# EAGLE design Altimeter (EAGLE 8.1.0)
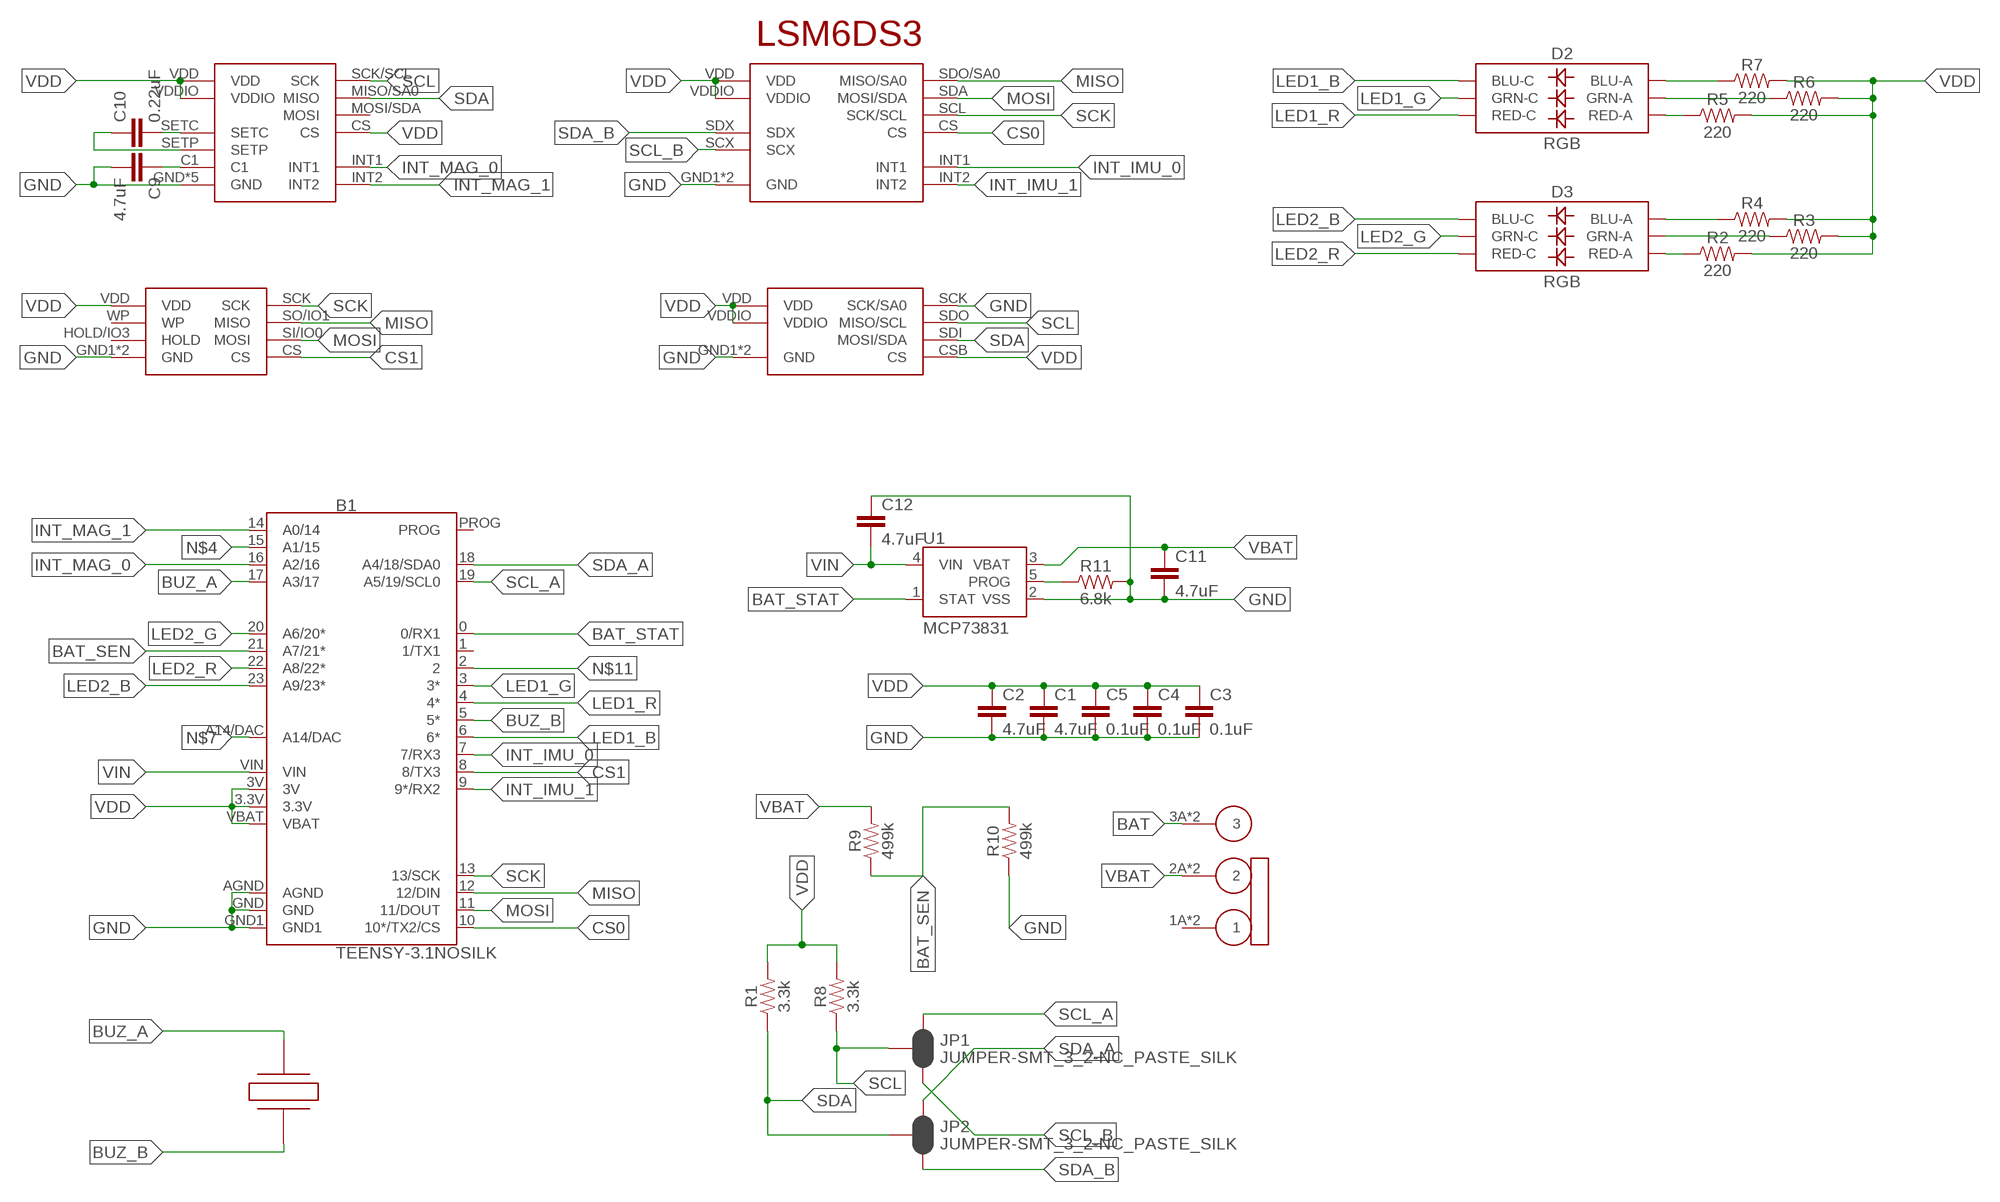
[diagram p0: schematic, sheet 1]

## Parts
B1  TEENSY-3.1NOSILK  [TEENSY-3.1_NOSILK]
C1  4.7uF  4.7UF0603  [0603]
C2  4.7uF  4.7UF0603  [0603]
C3  0.1uF  0.1UF-0603-25V-5%  [0603]
C4  0.1uF  0.1UF-0603-25V-5%  [0603]
C5  0.1uF  0.1UF-0603-25V-5%  [0603]
C9  4.7uF  4.7UF0603  [0603]
C10  0.22uF  0.22UF-0603-25V-10%  [0603]
C11  4.7uF  4.7UF0603  [0603]
C12  4.7uF  4.7UF0603  [0603]
D2  RGB  LED-RGBPLCC-6  [PLCC-6-LED]
D3  RGB  LED-RGBPLCC-6  [PLCC-6-LED]
JP1  JUMPER-SMT_3_2-NC_PASTE_SILK  [SMT-JUMPER_3_2-NC_PASTE_SILK]
JP2  JUMPER-SMT_3_2-NC_PASTE_SILK  [SMT-JUMPER_3_2-NC_PASTE_SILK]
R1  3.3k  3.3KOHM-0603-1/10W-1%  [0603]
R2  220  22OHM-0603-1/10W-1%  [0603]
R3  220  22OHM-0603-1/10W-1%  [0603]
R4  220  22OHM-0603-1/10W-1%  [0603]
R5  220  22OHM-0603-1/10W-1%  [0603]
R6  220  22OHM-0603-1/10W-1%  [0603]
R7  220  22OHM-0603-1/10W-1%  [0603]
R8  3.3k  3.3KOHM-0603-1/10W-1%  [0603]
R9  499k  1MOHM-0603-1/4W-5%  [0603]
R10  499k  1MOHM-0603-1/4W-5%  [0603]
R11  6.8k  2.0KOHM-0603-1/10W-5%  [0603]
U1  MCP73831  [SOT23-5]
U$1  BMP280  [BMP280]
U$3  JS102011JAQN  [JS102011JAQN]
U$5  LSM6DS3  [LSM6DS3]
U$6  LSM303D  [LSM303D]
U$7  PKLCS1212  [PKLCS1212]
U$8  S25FL256S  [S25FL256S]

## Nets
BAT: U$3.3A U$3.3B
BAT_SEN: B1.21(A7/21*) R9.1 R10.2
BAT_STAT: B1.0(0/RX1) U1.1(STAT)
BUZ_A: B1.17(A3/17) U$7.2
BUZ_B: B1.5(5*) U$7.1
CS0: B1.10(10*/TX2/CS) U$5.CS
CS1: B1.8(8/TX3) U$8.CS
GND: B1.AGND B1.GND B1.GND1 C1.2 C2.2 C3.2 C4.2 C5.2 C9.2 C11.2 C12.1 R10.1 R11.2 U1.2(VSS) U$1.GND1(GND) U$1.GND2(GND) U$1.SCK(SCK/SA0) U$5.GND1(GND) U$5.GND2(GND) U$6.GND U$6.GND1(GND) U$6.GND2(GND) U$6.GND3(GND) U$6.GND4(GND) U$8.GND1(GND) U$8.GND2(GND)
INT_IMU_0: B1.7(7/RX3) U$5.INT1
INT_IMU_1: B1.9(9*/RX2) U$5.INT2
INT_MAG_0: B1.16(A2/16) U$6.INT1
INT_MAG_1: B1.14(A0/14) U$6.INT2
LED1_B: B1.6(6*) D2.CB(BLU-C)
LED1_G: B1.3(3*) D2.CG(GRN-C)
LED1_R: B1.4(4*) D2.CR(RED-C)
LED2_B: B1.23(A9/23*) D3.CB(BLU-C)
LED2_G: B1.20(A6/20*) D3.CG(GRN-C)
LED2_R: B1.22(A8/22*) D3.CR(RED-C)
MISO: B1.12(12/DIN) U$5.SDO/SA0(MISO/SA0) U$8.SO/IO1(MISO)
MOSI: B1.11(11/DOUT) U$5.SDA(MOSI/SDA) U$8.SI/IO0(MOSI)
N$1: D2.AB(BLU-A) R7.1
N$3: D2.AG(GRN-A) R6.1
N$4: B1.15(A1/15)
N$6: R11.1 U1.5(PROG)
N$7: B1.A14/DAC
N$9: D2.AR(RED-A) R5.1
N$11: B1.2
N$30: D3.AB(BLU-A) R4.1
N$33: D3.AG(GRN-A) R3.1
N$42: D3.AR(RED-A) R2.1
N$46: C10.2 U$6.SETC
N$47: C10.1 U$6.SETP
N$48: C9.1 U$6.C1
SCK: B1.13(13/SCK) U$5.SCL(SCK/SCL) U$8.SCK
SCL: JP1.2 R8.1 U$1.SDO(MISO/SCL) U$6.SCK/SCL(SCK)
SCL_A: B1.19(A5/19/SCL0) JP1.1
SCL_B: JP1.3 U$5.SCX
SDA: JP2.2 R1.1 U$1.SDI(MOSI/SDA) U$6.MISO/SA0(MISO)
SDA_A: B1.18(A4/18/SDA0) JP2.1
SDA_B: JP2.3 U$5.SDX
VBAT: C11.1 R9.2 U1.3(VBAT) U$3.2A U$3.2B
VDD: B1.3.3V B1.3V B1.VBAT C1.1 C2.1 C3.1 C4.1 C5.1 R1.2 R2.2 R3.2 R4.2 R5.2 R6.2 R7.2 R8.2 U$1.CSB(CS) U$1.VDD U$1.VDDIO U$5.VDD U$5.VDDIO U$6.CS U$6.VDD U$6.VDDIO U$8.VDD
VIN: B1.VIN C12.2 U1.4(VIN)
Unconnected: B1.1(1/TX1) B1.PROG U$3.1A U$3.1B U$6.MOSI/SDA(MOSI) U$8.HOLD/IO3(HOLD) U$8.WP

## Library data of the parts
B1 = SparkFun-Boards:TEENSY-3.1: Teensy 3+ Footprint Mechanical footprint with connectors for Teensy Development Board with ARM Cortex. SparkFun Products: Teensy 3.2 <https://www.sparkfun.com/products/13736> Teensy LC <https://www.sparkfun.com/products/13305>; SF_ID: DEV-12646
C1 C2 C9 C11 C12 = SparkFun-Capacitors:4.7UF: 4.7µF ceramic capacitors A capacitor is a passive two-terminal electrical component used to store electrical energy temporarily in an electric field.; PROD_ID: CAP-08280
C3-C5 = SparkFun-Capacitors:0.1UF: 0.1µF ceramic capacitors A capacitor is a passive two-terminal electrical component used to store electrical energy temporarily in an electric field.; PROD_ID: CAP-08604
C10 = SparkFun-Capacitors:0.22UF: 0.22µF ceramic capacitors A capacitor is a passive two-terminal electrical component used to store electrical energy temporarily in an electric field.; PROD_ID: CAP-07822
D2 D3 = SparkFun-LED:LED-RGB: LED-RGB 6 pin RGB LED (no common connector) Packages: PLCC-6 LED-TRICOLOR-5050 - No built-in IC SparkFun Products: Digital Sandbox <https://www.sparkfun.com/products/12651> LED- SMD RGB <https://www.sparkfun.com/products/10866>; PROD_ID: DIO-12113
JP1 JP2 = SparkFun-Jumpers:JUMPER-SMT_3_2-NC_PASTE: Normally closed solder jumper (2 of 2 connections) This jumper has an aperture in the stencil to allow solder paste to bridge both connections. Both connections are normally closed (NC). Wick off the solder to open the connection(s). Reapply solder to reclose the connection(s).
R1 R8 = SparkFun-Resistors:3.3KOHM: 3.3kΩ resistor A resistor is a passive two-terminal electrical component that implements electrical resistance as a circuit element. Resistors act to reduce current flow, and, at the same time, act to lower voltage levels within circuits. - Wikipedia; PROD_ID: RES-07851
R2-R7 = SparkFun-Resistors:22OHM: 22Ω resistor A resistor is a passive two-terminal electrical component that implements electrical resistance as a circuit element. Resistors act to reduce current flow, and, at the same time, act to lower voltage levels within circuits. - Wikipedia; PROD_ID: RES-08698; VALUE: 22
R9 R10 = SparkFun-Resistors:1MOHM: 1MΩ resistor A resistor is a passive two-terminal electrical component that implements electrical resistance as a circuit element. Resistors act to reduce current flow, and, at the same time, act to lower voltage levels within circuits. - Wikipedia; PROD_ID: RES-07868; VALUE: 1M
R11 = SparkFun-Resistors:2.0KOHM: 2kΩ resistor A resistor is a passive two-terminal electrical component that implements electrical resistance as a circuit element. Resistors act to reduce current flow, and, at the same time, act to lower voltage levels within circuits. - Wikipedia; PROD_ID: RES-08296; VALUE: 2.0k
U1 = SparkFun-IC-Power:MCP73831: MCP73831T Li-Ion, Li-Pol Controller Miniature single cell, fully integrated Li-Ion, Li-polymer charge management controller Datasheet <http://ww1.microchip.com/downloads/en/DeviceDoc/20001984g.pdf> SparkFun Products: SparkFun ESP32 Thing <https://www.sparkfun.com/products/13907> SparkFun 9DoF Razor IMU M0 <https://www.sparkfun.com/products/14001>; PROD_ID: IC-09995
U$1 = Altimeter:BMP280
U$3 = Altimeter:JS102011JAQN
U$5 = Altimeter:LSM6DS3
U$6 = Altimeter:LSM303D
U$7 = Altimeter:PKLCS1212
U$8 = Altimeter:S25FL256S

## Board
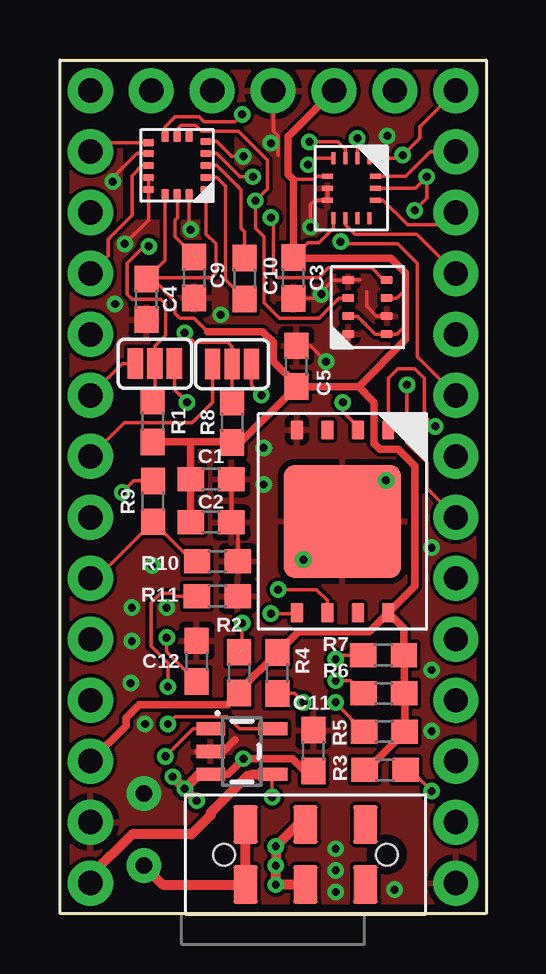
[diagram p1: board, top side]
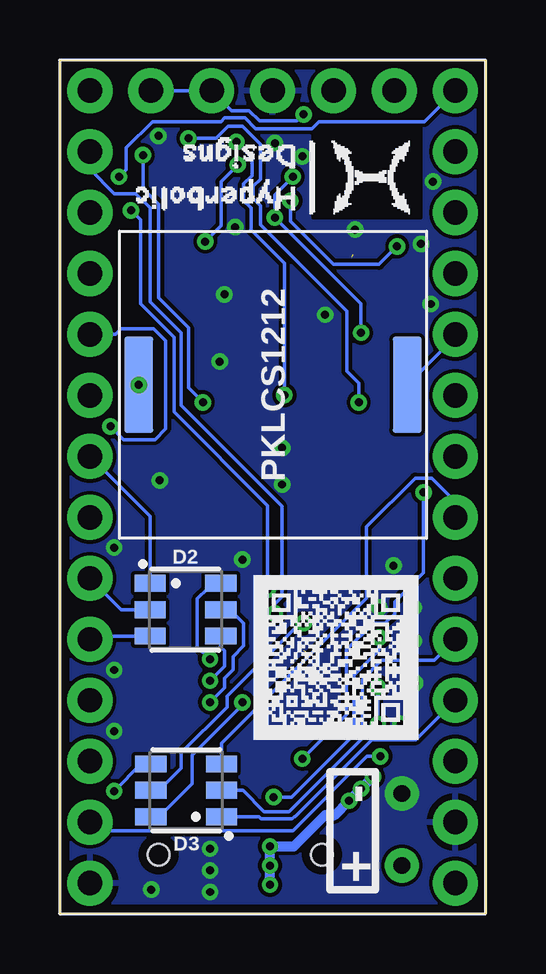
[diagram p2: board, bottom side, seen from below]

Size 17.76 x 35.56 mm. Coordinates in mm from the lower left corner, seen from the top.
Outline: 0,0 17.76,0 17.76,35.56 0,35.56 0,0
Copper layers (1*16): Top 0.035mm / dielectric 1.5mm / Bottom 0.035mm
Design rules "default *": minimum track width 6mil, minimum drill 13mil, track to track 6mil, track to pad 6mil, pad to pad 6mil, via to via 6mil, smd to smd 6mil, copper to edge 15mil, drill to drill 6mil, minimum pad ring 7mil, minimum via ring 7mil, stop-mask expansion 4mil, vias tented up to drill 15mil, thermal gap 10mil
tRestrict: area 2.7,29 to 7.2,33.1; area 11.3,29.4 to 12.8,31.1
bRestrict: area 2.7,29 to 7.2,33.1

### Footprints (pad centres in the part's own frame; a part is rotated, then mirrored left to right if it is on the bottom)
TEENSY-3.1_NOSILK = drill 1.016 pad 1.88: 0 7.62,-13.97; 1 7.62,-11.43; 2 7.62,-8.89; 3 7.62,-6.35; 3.3V 2.54,16.51; 3V -7.62,-11.43; 4 7.62,-3.81; 5 7.62,-1.27; 6 7.62,1.27; 7 7.62,3.81; 8 7.62,6.35; 9 7.62,8.89; 10 7.62,11.43; 11 7.62,13.97; 12 7.62,16.51; 13 -7.62,16.51; 14 -7.62,13.97; 15 -7.62,11.43; 16 -7.62,8.89; 17 -7.62,6.35; 18 -7.62,3.81; 19 -7.62,1.27; 20 -7.62,-1.27; 21 -7.62,-3.81; 22 -7.62,-6.35; 23 -7.62,-8.89; A14/DAC -5.08,16.51; AGND -7.62,-13.97; GND 0,16.51; GND1 7.62,-16.51; PROG -2.54,16.51; VBAT 5.08,16.51; VIN -7.62,-16.51
0603 = smd 1.1 x 1: 1 -0.85,0; 2 0.85,0
PLCC-6-LED = smd 1.3 x 0.7: AB 1.475,1.1; AG 1.475,-1.1; AR 1.475,0; CB -1.475,1.1; CG -1.475,-1.1; CR -1.475,0
SMT-JUMPER_3_2-NC_PASTE_SILK = smd 0.635 x 1.27: 1 -0.813,0; 2 0,0; 3 0.813,0
SOT23-5 = smd 0.55 x 1.2: 1 -0.95,-1.3; 2 0,-1.3; 3 0.95,-1.3; 4 0.95,1.3; 5 -0.95,1.3
BMP280 = smd 0.5 x 0.35: CSB 0.8,0.375; GND1 0.8,1.125; GND2 -0.8,0.375; SCK 0.8,-1.125; SDI 0.8,-0.375; SDO -0.8,-1.125; VDD -0.8,1.125; VDDIO -0.8,-0.375
JS102011JAQN = smd 1 x 1.6: 1A -2.5,-1.25; 1B -2.5,1.25; 2A 0,-1.25; 2B 0,1.25; 3A 2.5,-1.25; 3B 2.5,1.25 | hole 0.9: -3.4,0; 3.4,0
LSM6DS3 = smd 0.5 x 0.2: CS 2,0.75; GND1 0,1.25; GND2 0,0.75; SCL 2,1.25; SDA 2,1.75; VDDIO 0,1.75 | smd 0.2 x 0.5: INT1 0.25,2.5; INT2 0.75,0; NC1 1.25,0; NC2 1.75,0; SCX 0.75,2.5; SDO/SA0 1.75,2.5; SDX 1.25,2.5; VDD 0.25,0
LSM303D = smd 0.3 x 0.45: C1 0,1.2; CS 0.5,-1.2; GND -0.5,1.2; MISO/SA0 0,-1.2; MOSI/SDA -0.5,-1.2; VDD 0.5,1.2 | smd 0.45 x 0.3: GND1 -1.2,-1; GND2 1.2,-0.5; GND3 1.2,0.5; GND4 1.2,1; INT1 1.2,0; INT2 1.2,-0.95; SCK/SCL -1.2,-0.5; SETC -1.2,0.5; SETP -1.2,0; VDDIO -1.2,1
PKLCS1212 = smd 1.2 x 4: 1 0,0; 2 11.2,0
S25FL256S = smd 0.8 x 0.5: CS -3.81,1.905; GND1 -3.81,-1.905; HOLD/IO3 3.81,0.635; SCK 3.81,-0.635; SI/IO0 3.81,-1.905; SO/IO1 -3.81,0.635; VDD 3.81,1.905; WP -3.81,-0.635 | smd 4.7 x 4.9: GND2 0,0

### Placement (x,y rotation side)
B1  8.89,17.78 0 top
C1  6.3,18.1 0 top
C2  6.3,16.3 0 top
C3  9.73,26.48 270 top
C4  3.6,25.59 270 top
C5  9.86,22.81 90 top
C9  5.59,26.5 270 top
C10  7.7,26.46 270 top
C11  10.57,6.79 90 top
C12  5.7,10.52 270 top
D2  12.53,12.66 0 bottom
D3  12.49,5.13 180 bottom
JP1  7.17,22.89 0 top
JP2  3.96,22.91 0 top
R1  3.86,20.5 270 top
R2  7.47,10.04 270 top
R3  13.56,6 180 top
R4  9.07,10.03 90 top
R5  13.53,7.58 0 top
R6  13.51,9.17 0 top
R7  13.49,10.77 0 top
R8  7.17,20.47 270 top
R9  3.88,17.18 90 top
R10  6.57,14.68 180 top
R11  6.57,13.23 0 top
U1  7.59,6.75 270 top
U$1  12.82,25.27 180 top
U$3  10.24,2.46 180 top
U$5  11.15,28.98 0 top
U$6  4.89,31.17 180 top
U$7  14.47,22.03 0 bottom
U$8  11.79,16.34 270 top

### Tracks (layer width: path | path; a pad name or v marks a point on that pad's centre or on a via)
BAT  (via drill 0.7 pad 1.42)
  Top 0.406: v3.5,2 4.29,1.21 U$3.3B U$3.3A
BAT_SEN
  Top 0.152: B1.21 1.53,13.97 R9.1 5.53,14.68 R10.2
BAT_STAT  (via drill 0.33)
  Top 0.152: U1.1 5.55,7.7 v4.4,6.55
  Bottom 0.152: 16.45,3.81 B1.0 16.15,3.45 8.05,3.45 4.95,6.55 v4.4,6.55
BUZ_A
  Bottom 0.152: U$7.2 1.27,24.04 B1.17
BUZ_B  (via drill 0.33)
  Top 0.152: B1.5 15.3,17.72 15.3,18.8 14.47,19.62 U$7.1
  other vias: 14.47,22.03
CS0
  Top 0.152: U$5.CS 13.47,29.73 14.5,28.7 16,28.7 B1.10
CS1  (via drill 0.33)
  Top 0.152: v15.65,20.3 15.2,20.75 15.2,22.3 14.8,22.7 14.1,22.7 13.7,22.3 U$8.CS
  Bottom 0.152: B1.8 15.43,24.13 15.2,24.36 13.85,24.36 13.35,23.86 13.35,20.2 13.8,19.75 15.1,19.75 v15.65,20.3
GND  (via drill 0.33, 0.7 pad 1.42)
  Top 0.152: U$6.GND3 U$6.GND4 3.69,28.89 v2.7,27.9 | U$6.GND1 6.53,32.17 7.15,31.55 v7.65,31.55 | C3.2 10.63,25.64 11.39,26.39 U$1.SCK 12.5,26.4 | U$1.GND2 13.21,24.89 12.8,25.3 12.8,25.9 | C5.2 10.44,23.66 v11.1,23 | U$1.GND1 12.03,23.93 | U$5.GND1 U$5.GND2 10.62,29.73 10.45,29.55 v10.45,28.6 | U$6.GND 5.39,28.56 v5.45,28.5 | 9.1,31.6 9.1,32.4 8.9,32.6 B1.GND | 9.88,18.25 arc90 U$8.GND2 11.74,16.34 v10.15,14.75 | C1.2 C2.2 7.42,16.03 R10.1 | 5.7,11.62 C12.1 | v2.2,30.5 2.2,30.65 3.22,31.67 U$6.GND2
  Top 0.305: 6.55,6.75 U1.2 | U1.2 5.75,6.75 | B1.AGND | U1.2 6.8,6.75 7.3,7.25
  other vias: 2.3,25.4 2.95,9.6 3,11.35 3.85,14.5 15.5,7.6 15.5,15.25 13.6,18.05 3.55,7.9 13.65,32.4 6.7,24.95 10.9,25.8 8.5,19.4 13.95,1 4.45,12.75 3,12.75 15.5,10.15 8.8,32.1 11.5,2.7 11.5,1.8 11.5,0.9 8.5,17.88 3.5,5
  pour Top (rank 2): 0,0.05 0,35.55 17.75,35.55 17.75,0.05
  pour Bottom (rank 2): 0,0.05 0,35.55 17.75,35.55 17.75,0.05
INT_IMU_0  (via drill 0.33)
  Top 0.152: B1.7 14.9,23.2 14.9,27.1 14.1,27.9 11.8,27.9 v11.7,28 | U$5.INT1 10.62,31.48 v10.35,31.2
  Bottom 0.152: v10.35,31.2 10.35,31.18 11.05,30.48 11.05,28.65 v11.7,28
INT_IMU_1
  Top 0.152: B1.9 14.88,28.3 12.3,28.3 11.9,28.7 U$5.INT2
INT_MAG_0
  Top 0.152: U$6.INT1 3.42,31.17 3,30.75 3,29.1 2,28.1 2,27.4 B1.16
INT_MAG_1
  Top 0.152: U$6.INT2 1.64,32.12 B1.14
LED1_B
  Bottom 0.152: B1.6 14.01,16.55 D2.CB
LED1_G
  Bottom 0.152: B1.3 16.38,11.56 D2.CG
LED1_R
  Bottom 0.152: B1.4 15.21,12.66 D2.CR
LED2_B
  Bottom 0.152: D3.CB 9.47,4.04 9.38,3.94 8.07,3.94 7.98,4.04 7.96,4.04 4.75,7.25 2.91,7.25 B1.23
LED2_G
  Bottom 0.152: D3.CG 11.02,7.09 4.98,13.13 4.98,16.12 2.95,18.15 2.25,18.15 1.27,17.16 B1.20
LED2_R
  Bottom 0.152: B1.22 2.15,10.55 4.35,10.55 5.15,9.75 5.15,7.3 8.2,4.25 9.25,4.25 10.13,5.13 D3.CR
MISO  (via drill 0.33)
  Top 0.152: B1.12 15,32.78 15,32.3 v14.3,31.6 14.18,31.48 U$5.SDO/SA0 | v11.8,21.3 11.8,20.9 12.43,20.27 U$8.SO/IO1
  Bottom 0.152: v14.3,31.6 14.3,30.2 13.65,29.55 13.65,25.65 12.4,24.4 12.4,21.9 v11.8,21.3
MOSI  (via drill 0.33)
  Top 0.152: B1.11 15.45,31.75 14.43,30.73 U$5.SDA | U$8.SI/IO0 9.86,12.5 v8.8,12.5
  Bottom 0.152: B1.11 16.51,31.01 15.5,30 14.6,30 14,29.4 14,25.5 12.71,24.2 12.71,21.17 8.5,16.97 8.5,13.2 8.8,12.9 v8.8,12.5
N$1  (via drill 0.33)
  Top 0.152: R7.1 11.67,10.77 v11.5,10.6
  Bottom 0.152: v11.5,10.6 11.5,10.59 12.03,11.12 12.03,13.11 11.6,13.54 11.6,13.7 11.12,13.7 D2.AB
N$3  (via drill 0.33)
  Top 0.152: R6.1 12.13,9.7 v11.5,9.7
  Bottom 0.152: D2.AG 11.05,11.1 10.9,10.95 10.9,10.3 v11.5,9.7
N$6  (via drill 0.33)
  Top 0.152: U1.5 7.49,7.7 6.99,8.2 4.8,8.2 v4.5,7.9 | 5.7,13.25 R11.1 4.81,13.23 4.7,13.35 4.2,13.35 3.8,12.94 3.8,11.13 4.5,10.43 v4.5,9.45
  Bottom 0.152: v4.5,7.9 v4.5,9.45
N$9  (via drill 0.33)
  Top 0.152: v11.5,8.8 11.5,8.76 R5.1
  Bottom 0.152: D2.AR 10.99,12.6 10.6,12.6 10.1,12.1 10.1,11.15 10.55,10.7 10.55,10.15 10.9,9.8 10.9,9.4 v11.5,8.8
N$30  (via drill 0.33)
  Top 0.152: R4.1 9.78,9.18 v10.15,8.8
  Bottom 0.152: D3.AB 13.62,4.04 12.25,5.4 12.25,6.6 10.15,8.7 v10.15,8.8
N$33  (via drill 0.33)
  Top 0.152: R3.1 14.61,6 v15.5,5.1
  Bottom 0.152: D3.AG 14.37,6.24 v15.5,5.1
N$42  (via drill 0.33)  (1 unrouted)
  Top 0.152: 7.6,10.96 v7.6,12.1
  Bottom 0.152: v7.6,12.1 7.75,12.1 10.8,9.05 10.8,8.6 12.7,6.7 12.7,6.05 13.62,5.13 D3.AR
N$46
  Top 0.152: U$6.SETC 6.53,30.67 6.9,30.3 6.9,26.41 C10.2
N$47
  Top 0.152: U$6.SETP 6.53,31.17 7.55,30.15 7.55,28.55 7.7,28.4 C10.1
N$48  (1 unrouted)
  Top 0.152: 5.55,27.45 4.8,28.2 4.8,28.9 4.9,29 U$6.C1
SCK  (via drill 0.33)
  Top 0.152: U$5.SCL 14.82,30.23 v15.3,30.7 15.3,29.8 v14.8,29.3 | v9.1,13.5 10.7,13.5 11.15,13.04 U$8.SCK
  Bottom 0.152: B1.13 2.56,33 6.95,33 7.25,32.7 9.6,32.7 10.05,33.15 10.9,33.15 11.05,33 13.9,33 15,31.9 15,31 v15.3,30.7 | v14.8,29.3 14.4,28.9 14.4,25.4 13.01,24.01 13.01,20.91 9.1,17 v9.1,13.5
SCL  (via drill 0.33)
  Top 0.152: U$6.SCK/SCL 6.53,31.67 7.5,30.7 v8.05,30.7 | R8.1 JP1.2 7.17,23.62 7,23.8 5.6,23.8 v5.2,24.2 | U$1.SDO 13.51,26.39 13,26.9 11.2,26.9 10.8,26.5 9.1,26.5 8.9,26.7 8.9,28.9 v8.8,29
  Bottom 0.152: v5.2,24.2 5.2,25.4 v8.8,29 8.8,29.95 v8.05,30.7
SCL_A
  Top 0.152: B1.19 2.67,20.45 5.5,20.45 6.36,21.31 JP1.1
SCL_B  (via drill 0.33)
  Top 0.152: 11.9,31.5 U$5.SCX 11.9,31.84 11.6,32.15 v10.4,32.15 | v8.4,21.6 7.99,22.01 JP1.3
  Bottom 0.152: v8.4,21.6 8.4,27.1 9.8,28.5 9.8,29.4 10.1,29.7 10.1,30.4 9.75,30.75 9.75,31.5 v10.4,32.15
SDA  (via drill 0.33)
  Top 0.152: U$6.MISO/SA0 4.89,32.69 5.05,32.85 5.65,32.85 5.9,32.6 7.44,32.6 8.65,31.4 8.65,30.2 v8.15,29.7 8.15,28.55 8.5,28.2 8.5,25.45 9.15,24.8 10.8,24.8 11.64,25.64 U$1.SDI | v3.7,27.8 3.5,27.8 2.8,27.1 2.8,25.8 3,25.6 4.2,25.6 4.4,25.4 4.4,24.1 3.96,23.66 JP2.2 3.96,21.45 R1.1
  Bottom 0.152: v8.15,29.7 8.15,28.85 6.35,27.05 4.45,27.05 v3.7,27.8
SDA_A
  Top 0.152: JP2.1 2.59,22.91 B1.18
SDA_B  (via drill 0.33)
  Top 0.152: JP2.3 4.77,21.83 v5.3,21.3 | U$5.SDX v12.4,32.3
  Bottom 0.152: v12.4,32.3 11.25,32.3 10.75,32.8 10.15,32.8 9.4,32.05 9.4,30.6 9.7,30.3 9.7,29.8 9.4,29.5 9.4,28.7 5.8,25.1 | v5.3,21.3 5.3,22.1 5.8,22.6 5.8,25.1 | 5.8,25.1
VBAT  (via drill 0.33)
  Top 0.152: R9.2 3.08,18.02 v2.6,17.55
  Top 0.305: C11.1 10.21,5.95 9.7,6.45 v7.65,6.45 7,5.8 U1.3
  Top 0.406: U1.3 5.8,5.8 v5.2,5.2 | U$3.2B v9.01,1.21 v9,1.2 v9,2 v9,2.8 9.91,3.71 U$3.2A | v4.7,5.7 v5.2,5.2 | v5.2,5.2 v5.7,4.7
  Bottom 0.152: v2.6,17.55 2.6,14.19 3.8,12.99 3.8,12.5 4.2,12.1 4.7,12.1 5.81,10.98 5.81,8.29 v7.65,6.45
  Bottom 0.406: v4.7,5.7 v5.2,5.2 v5.7,4.7 6.3,4.1 6.7,4.1 8,2.8 v9,2.8 v9,2 v9,1.2
VDD  (via drill 0.33)
  Top 0.152: 14.4,24.5 14.04,24.14 U$1.VDD 13.15,24.14 12.4,24.89 U$1.CSB | 14.4,26 14.04,25.64 U$1.VDDIO | U$5.VDD 11.4,28.55 10.8,27.95 10.35,27.95 C3.1 | 10.93,30.73 U$5.VDDIO 10.72,30.73 10.6,30.6 9.76,30.6 9.73,30.57 | U$6.VDDIO 6.09,28.31 6.5,27.9 6.5,26.7 6.3,26.5 3.6,26.5 C4.1 | 6.15,24.25 5.6,24.8 5,24.8 4.8,25 4.8,25.5 3.85,26.45 | C5.1 9.86,22.05 | 3.92,26.45 3.85,26.45 | 3.85,26.45 C4.1 | U$6.VDD 4.39,27.23 C4.1 | U$6.CS 4.39,32.79 4.8,33.2 5.8,33.2 6,33 7.3,33 v7.6,33.3 | 5.45,19.66 5.5,19.66
  Top 0.305: B1.3.3V 9.5,32.36 9.5,30.8 9.73,30.57 C3.1 9.73,27.3 13.8,27.3 14.4,26.7 14.4,26 14.4,24.5 14.4,23.9 12.46,21.96 | 6.15,24.25 8.45,24.25 8.9,23.8 8.9,23 9.86,22.05 | 5.5,19.66 R1.2 | 5.5,19.66 7.14,19.66 R8.2 7.51,19.62 C5.1 12.46,21.96 | U$8.VDD 14.8,13.63 14.8,18.65 14.11,19.34 13.35,19.34 13.1,19.59 13.1,21.3 12.46,21.94 12.46,21.96 | U$8.VDD 14.35,11.88 R7.2 14.36,10.76 R6.2 14.38,9.15 R5.2 | U$8.VDD 12.91,11.75 9.95,11.75 R4.2 | R5.2 14.39,7.57 | R4.2 9.04,10.91 | R3.2 12.8,6 R5.2 | 1.25,6.35 B1.3V 2.75,7.83 2.75,8.15 3.3,8.7 6.99,8.7 R2.2 7.47,9.28 R4.2 | C2.1 C1.1 5.45,19.61 5.5,19.66
  Bottom 0.152: B1.VBAT B1.3.3V 10.6,33.45 9.87,33.45 9.44,33.02 7.88,33.02 v7.6,33.3
VIN  (via drill 0.33)
  Top 0.152: U1.4 8.85,5.76 v8.85,4.85 | v4.45,11.5 4.45,10.91 C12.2
  Top 0.406: U1.4 8.02,5.8 7.95,5.73 7.81,5.73 6.3,4.21 6.3,4.11 5.49,3.3 3,3.3 1.27,1.57 B1.VIN
  Bottom 0.152: v4.45,11.5 4.45,10.98 5.5,9.93 5.5,7.45 8.1,4.85 v8.85,4.85

### Text on the board
bPlace: - | +